# EAGLE design plan2 (EAGLE 9.3.0)
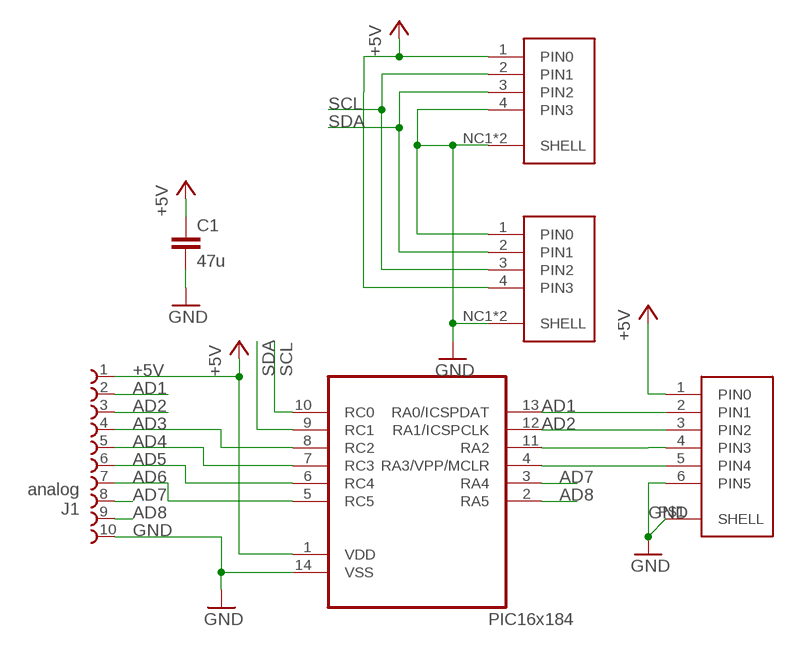
[diagram p0: schematic, sheet 1]

## Parts
C1  47u  C-EUC0805  [C0805]
J1  analog  68611014422  [68611014422]
MAINCON  PIC16F18424  [14-TSSOP]
U$2  IIC1  JST_ZH_4PIN  [JST_ZH_4PIN]
U$3  IIC2  JST_ZH_4PIN  [JST_ZH_4PIN]
U$4  programming  JST_ZH_6PIN  [JST_ZH_6PIN]

## Nets
+5V: C1.1 J1.1 MAINCON.1(VDD) U$2.1(PIN0) U$3.4(PIN3) U$4.1(PIN0)
AD1: J1.2 MAINCON.13(RA0/ICSPDAT) U$4.2(PIN1)
AD2: J1.3 MAINCON.12(RA1/ICSPCLK) U$4.3(PIN2)
AD3: J1.4 MAINCON.8(RC2)
AD4: J1.5 MAINCON.7(RC3)
AD5: J1.6 MAINCON.6(RC4)
AD6: J1.7 MAINCON.5(RC5)
AD7: J1.8 MAINCON.3(RA4)
AD8: J1.9 MAINCON.2(RA5)
GND: C1.2 J1.10 MAINCON.14(VSS) U$2.4(PIN3) U$2.NC1(SHELL) U$2.NC2(SHELL) U$3.1(PIN0) U$3.NC1(SHELL) U$3.NC2(SHELL) U$4.6(PIN5) U$4.P$1(SHELL)
N$7: MAINCON.11(RA2) U$4.4(PIN3)
N$8: MAINCON.4(RA3/VPP/MCLR) U$4.5(PIN4)
SCL: MAINCON.10(RC0) U$2.2(PIN1) U$3.3(PIN2)
SDA: MAINCON.9(RC1) U$2.3(PIN2) U$3.2(PIN1)

## Library data of the parts
C1 = rcl:C-EU: CAPACITOR, European symbol; SPICEPREFIX: C
J1 = Wurth_Elektronik_Electromechanic_FPC_Connectors_&_Flat_Flexible_Cable_rev18c:68611014422: WR-FPC 1.00mm SMT ZIF Horizontal Bottom Contact, 10 Pins=>Code : Con_FPC_ZIF_1.00_68611014422 <http://katalog.we-online.de/media/images/eican/Con_FPC_ZIF_1.00_6861xx14422_pf2.jpg> Details see: http://katalog.we-online.de/en/em/686_1xx_144_22 Created 2014-07-09, Karrer Zheng 2014 (C) Würth Elektronik
MAINCON = ORBiT-IC-PIC:PIC16F18424
U$2 U$3 = ORBiT-con-JST:JST_ZH_4PIN
U$4 = ORBiT-con-JST:JST_ZH_6PIN

## Board
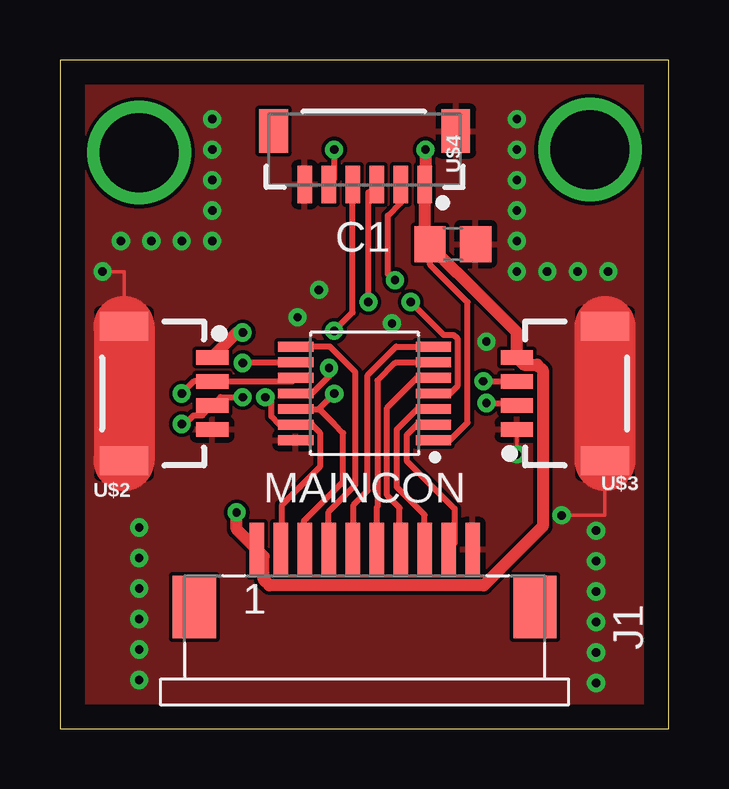
[diagram p1: board, top side]
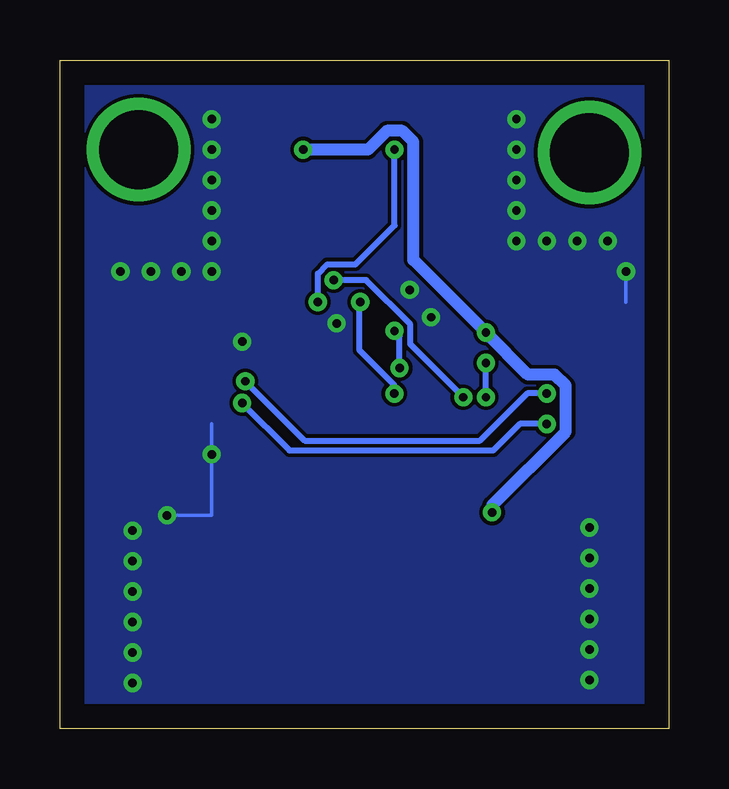
[diagram p2: board, bottom side, seen from below]

Size 25.38 x 27.86 mm. Coordinates in mm from the lower left corner, seen from the top.
Outline: 0,0 25.38,0 25.38,27.86 0,27.86 0,0
Copper layers (1*16): Top 0.035mm / dielectric 1.5mm / Bottom 0.035mm
Design rules "default": minimum track width 6mil, minimum drill 0.35mm, track to track 6mil, track to pad 6mil, pad to pad 6mil, via to via 6mil, smd to smd 6mil, copper to edge 40mil, drill to drill 6mil, minimum pad ring 10mil, minimum via ring 8mil, stop-mask expansion 4mil, vias tented up to drill 0mil, thermal gap 10mil

### Footprints (pad centres in the part's own frame; a part is rotated, then mirrored left to right if it is on the bottom)
C0805 = smd 1.3 x 1.5: 1 -0.95,0; 2 0.95,0
68611014422 = smd 0.6 x 2.2: 1 -4.5,2.4; 2 -3.5,2.4; 3 -2.5,2.4; 4 -1.5,2.4; 5 -0.5,2.4; 6 0.5,2.4; 7 1.5,2.4; 8 2.5,2.4; 9 3.5,2.4; 10 4.5,2.4 | smd 1.8 x 2.6: Z1 -7.1,0; Z2 7.1,0
14-TSSOP = smd 1.469 x 0.407: 1 -2.871,1.95; 2 -2.871,1.3; 3 -2.871,0.65; 4 -2.871,0; 5 -2.871,-0.65; 6 -2.871,-1.3; 7 -2.871,-1.95; 8 2.871,-1.95; 9 2.871,-1.3; 10 2.871,-0.65; 11 2.871,0; 12 2.871,0.65; 13 2.871,1.3; 14 2.871,1.95
JST_ZH_4PIN = smd 0.6 x 1.35: 1 -1.5,0; 2 -0.5,0; 3 0.5,0; 4 1.5,0 | smd 1.2 x 2: NC1 2.8,-3.675; NC2 -2.8,-3.675
JST_ZH_6PIN = smd 0.6 x 1.55: 1 -2.5,1.45; 2 -1.5,1.45; 3 -0.5,1.45; 4 0.5,1.45; 5 1.5,1.45; 6 2.5,1.45 | smd 1.2 x 1.8: P$1 -3.8,-0.775; P$2 3.8,-0.775

### Placement (x,y rotation side)
C1  16.38,20.19 0 top
J1  12.7,5.08 0 top
MAINCON  12.7,13.97 180 top
U$2  6.35,13.97 270 top
U$3  19.05,13.97 90 top
U$4  12.7,24.13 180 top

### Tracks (layer width: path | path; a pad name or v marks a point on that pad's centre or on a via)
+5V  (via drill 0.35)
  Top 0.254: MAINCON.1 15.66,11.93 16.17,11.93 16.99,12.76 16.99,17.78 15.43,19.34 C1.1
  Top 0.508: U$2.1 7.39,16.51 v7.62,16.51 | v15.24,24.13 15.24,22.72 U$4.1 15.2,20.14 15.43,19.91 C1.1 15.43,20.12 15.6,19.95 16.52,19.04 19.05,16.51 U$3.4 19.34,15.18 19.89,15.18 20.13,14.94 20.13,8.44 17.67,5.97 8.73,5.97 8.49,6.21 8.49,7.19 J1.1 7.37,8.31 v7.37,9.02
  Bottom 0.508: v15.24,24.13 12.54,24.13 11.76,24.91 11.11,24.91 10.64,24.45 10.64,19.54 v7.62,16.51 5.87,14.76 4.75,14.76 4.29,14.29 4.29,12.38 7.37,9.3 v7.37,9.02
AD1  (via drill 0.35)
  Top 0.254: J1.2 9.24,7.52 9.24,9.31 10.84,10.91 10.84,12.34 10.51,12.67 MAINCON.13 9.15,12.67 8.81,13 8.81,13.68 8.69,13.81 v8.56,13.81 | v13.97,18.69 13.92,18.69 13.67,18.94 13.67,21.38 14.2,21.91 U$4.2
  Bottom 0.254: v8.56,13.81 10.77,16.02 10.77,16.85 12.61,18.69 v13.97,18.69
AD2  (via drill 0.35)
  Top 0.254: 11.43,12.7 10.81,13.32 10.16,13.32 MAINCON.12 | 11.43,12.7 10.8,13.33 v11.44,13.96 | 11.43,12.7 11.81,12.32 11.81,10.29 10.16,8.64 10.16,7.52 J1.3 | v12.86,17.78 12.86,22.34 U$4.3
  Bottom 0.254: v11.44,13.96 11.44,14.32 12.89,15.77 12.89,17.78 v12.86,17.78
AD3
  Top 0.254: J1.4 11.2,9.04 12.32,10.16 12.32,14.86 11.26,15.92 MAINCON.8
AD4
  Top 0.254: J1.5 12.24,7.52 12.24,9.33 12.83,9.92 12.83,14.73 14.02,15.92 MAINCON.7
AD5
  Top 0.254: MAINCON.6 15.54,15.24 13.97,15.24 13.23,14.5 13.23,9.24 13.2,9.21 J1.6
AD6
  Top 0.254: J1.7 14.16,7.52 14.16,9.2 13.64,9.72 13.64,13.37 14.89,14.62 MAINCON.5
AD7
  Top 0.254: J1.8 15.2,8.91 14.05,10.06 14.05,12.48 14.89,13.32 MAINCON.3
AD8
  Top 0.254: MAINCON.2 14.89,12.67 14.45,12.23 14.45,11.18 16.45,9.18 16.45,7.73 J1.9
GND  (via drill 0.35)
  Top 0.152: U$2.NC2 2.67,19.05 v1.78,19.05 | U$3.NC2 22.73,8.89 v20.92,8.89 | v19.05,11.43 U$3.1
  Top 2.54: U$2.NC2 U$2.NC1 | U$3.NC1 U$3.NC2
  Bottom 0.152: v1.78,19.05 1.78,17.78 | v20.92,8.89 19.05,8.89 v19.05,11.43 | v19.05,11.43 19.05,12.7 v19.05,11.43
  other vias: 6.35,25.4 6.35,24.13 6.35,22.86 6.35,21.59 6.35,20.32 5.08,20.32 3.81,20.32 2.54,20.32 22.86,19.05 21.59,19.05 20.32,19.05 19.05,24.13 19.05,22.86 19.05,21.59 19.05,20.32 19.05,19.05 3.3,7.11 3.3,5.84 3.3,4.57 3.3,3.3 3.3,2.03 22.35,8.26 22.35,6.99 22.35,5.71 22.35,4.45 22.35,3.17 22.35,1.91 9.91,17.14 10.79,18.29 17.78,16.13 19.05,25.4 3.3,8.38 13.84,16.89
  pour Bottom: 0,27.94 0,0 25.4,0 25.4,27.94
  pour Top: 0,27.94 0,0 25.4,0 25.4,27.94 24.13,27.94
N$1  (via drill 3.3)
  other vias: 22.1,24.13
N$2  (via drill 3.3)
  other vias: 3.3,24
N$7  (via drill 0.35)
  Top 0.254: MAINCON.11 9.87,14.01 10.55,14.01 11.22,14.68 v11.22,15.02 v11.22,15.03 | v11.43,16.58 12.2,17.35 U$4.4
  Bottom 0.254: v11.22,15.03 11.22,16.37 v11.43,16.58
N$8  (via drill 0.35)
  Top 0.254: MAINCON.4 15.66,13.88 16.17,13.88 16.59,14.3 16.59,16.24 16.42,16.4 16,16.4 v14.63,17.78 | v11.43,24.13 11.43,22.91 U$4.5
  Bottom 0.254: v11.43,24.13 11.43,20.98 13.06,19.35 14.24,19.35 14.63,18.96 v14.63,17.78
SCL  (via drill 0.35)
  Top 0.254: MAINCON.10 9.68,14.47 U$2.2 5.58,14.47 v5.08,13.97 | v17.65,14.48 17.66,14.47 U$3.3
  Bottom 0.254: v5.08,13.97 5.9,13.97 7.86,12.01 15.18,12.01 v17.65,14.48
SDA  (via drill 0.35)
  Top 0.254: v7.62,13.81 6.69,13.81 U$2.3 5.93,13.05 5.56,13.05 5.21,12.7 v5.08,12.7 | v7.62,15.24 7.65,15.27 MAINCON.9 | v17.78,13.57 18.95,13.57 U$3.2
  Bottom 0.254: v7.62,13.81 v7.62,15.24 | v5.08,12.7 6.21,12.7 7.31,11.6 15.81,11.6 v17.78,13.57